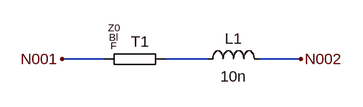
[diagram p0: schematic Draft1.asc]
Draft1.asc, the LTspice schematic file:
Version 4
SHEET 1 880 680
WIRE 128 160 64 160
WIRE 288 160 224 160
WIRE 432 160 368 160
FLAG 64 160 N001
FLAG 432 160 N002
SYMBOL TL 176 160 R0
SYMATTR InstName T1
SYMBOL ind 272 176 R270
WINDOW 0 32 56 VTop 2
WINDOW 3 5 56 VBottom 2
SYMATTR InstName L1
SYMATTR Value 10n

The netlist it stands for:
* Draft1.asc
T1 N001 N003 Z0 Bl F
L1 N003 N002 10n
.backanno
.end